# EasyEDA schematic Hysteresis.json
TITLE: Hysteresys for wind turbine; REV: 1.0; Date: 2024-12-05; Sheet: 1/1; Drawn By: AmirB; Company: Energy Exhibit
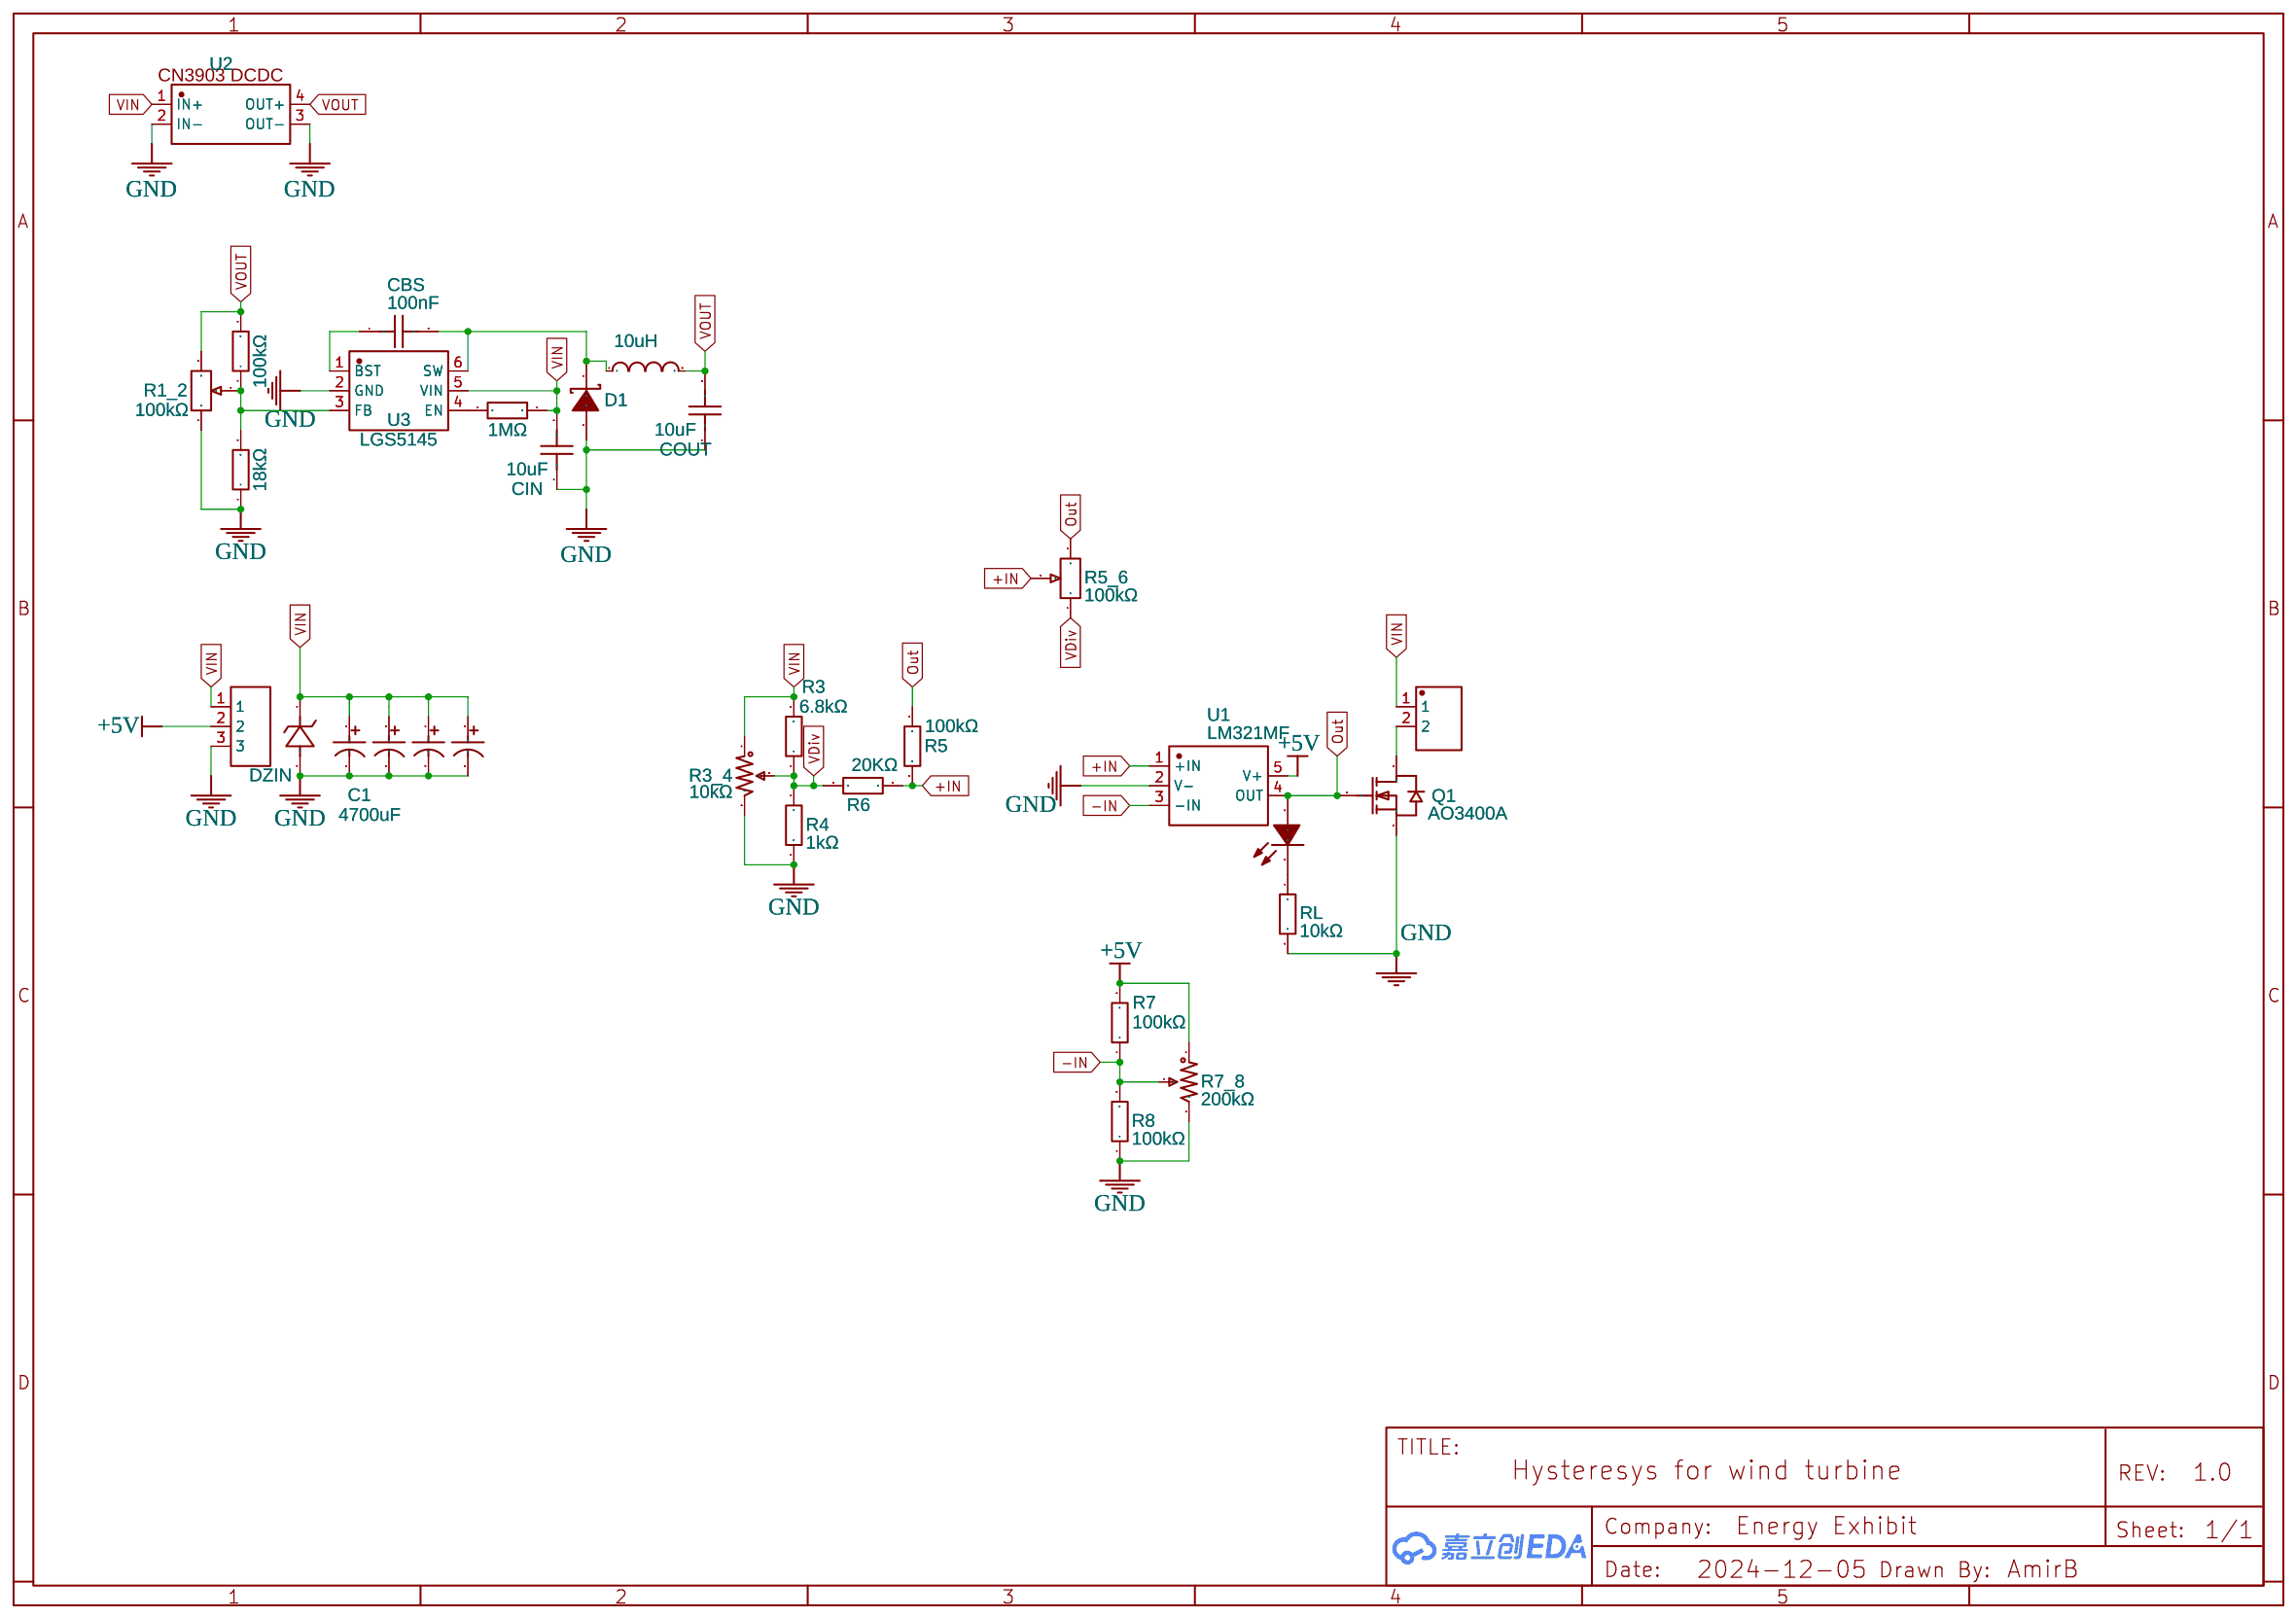
[diagram p0: schematic sheet]

## Parts
C1  4700uF  [CAP-TH_BD18.0-P7.50-D1.2-FD]
C2  4700uF  [CAP-TH_BD18.0-P7.50-D1.2-FD]
C3  4700uF  [CAP-TH_BD18.0-P7.50-D1.2-FD]
C4  4700uF  [CAP-TH_BD18.0-P7.50-D1.2-FD]
CBS  100nF  [C0603]
CIN  10uF  [C0805]
CON_VIN  FK2510  [CONN-TH_3P-P2.00_KF2510_3A]
COUT  10uF  [C0805]
D1  SS210  [SMA_L4.3-W2.6-LS5.2-RD]
DZIN  SMBJ5361B  [SMB_L4.3-W3.6-LS5.2-RD]
L1  10uH  [IND-SMD_L5.4-W5.2]
LED  KT-0603R  [LED0603-RD]
Q1  AO3400A  [SOT-23-3_L2.9-W1.3-P1.90-LS2.4-BR]
R1  100kΩ  [R0603]
R1_2  100kΩ  [RES-ADJ-TH_3P-L9.5-W4.9-P2.50-L_3296W]
R2  18kΩ  [R0603]
R3  6.8kΩ  [R0603]
R3_4  10kΩ  [RES-ADJ-TH_3P-L10.0-W10.0-P2.50-L]
R4  1kΩ  [R0603]
R5  100kΩ  [R0603]
R5_6  100kΩ  [RES-ADJ-TH_3P-L9.5-W4.9-P2.50-L_3296W]
R6  20KΩ  [R0603]
R7  100kΩ  [R0603]
R7_8  200kΩ  [RES-ADJ-TH_3P-L9.5-W4.85-P2.50-BL-BS]
R8  100kΩ  [R0603]
REN  1MΩ  [R0603]
RL  10kΩ  [R0603]
U1  LM321MF  [SOT-23-5_L2.9-W1.6-P0.95-LS2.8-BL]
U2  CN3903-DCDC-STEPDOWN-3V3  [CN3903 DCDC]
U3  LGS5145  [SOT-23-6_L2.9-W1.7-P0.95-LS2.8-BL]
VHYS  KF2510-2A  [CONN-TH_KF2510-2A]

## Library data of the parts
C1-C4 = 4700uF 35V 18*30: Supplier: LCSC; Manufacturer: CX(承兴); Supplier Part: C43354; JLCPCB Part Class: Extended Part; Package Display: No
CBS = CC0603KRX7R9BB104: Supplier: LCSC; Manufacturer: YAGEO(国巨); Supplier Part: C14663; JLCPCB Part Class: Basic Part; Package Display: No
CIN COUT = GRM21BR61H106KE43L: Contributor: LCSC; Supplier: LCSC; Supplier Part: C440198; Manufacturer: muRata(村田); JLCPCB Part Class: Basic Part; Package Display: No
CON_VIN = kf2510_3A: JLCPCB Part Class: Extended Part; Package Display: No
D1 = SS210: Supplier: LCSC; Manufacturer: MDD(辰达半导体); Supplier Part: C14996; JLCPCB Part Class: Basic Part; Package Display: No
DZIN = SMBJ5361B: Contributor: lcsc; Supplier: LCSC; Supplier Part: C2940171; Manufacturer: LGE(鲁光); JLCPCB Part Class: Extended Part; Package Display: No
L1 = MWSA0503S-100MT: Contributor: LCSC; Supplier: LCSC; Supplier Part: C408412; Manufacturer: Sunlord(顺络); JLCPCB Part Class: Extended Part; Package Display: No
LED = KT-0603R: Supplier: LCSC; Manufacturer: KENTO; Supplier Part: C2286; JLCPCB Part Class: Basic Part; Package Display: No
Q1 = AO3400A: Supplier: LCSC; Manufacturer: AOS; Supplier Part: C20917; JLCPCB Part Class: Basic Part; Package Display: No
R1 R5 R7 R8 = 0603WAF1003T5E: Supplier: LCSC; Manufacturer: UNI-ROYAL(厚声); Supplier Part: C25803; JLCPCB Part Class: Basic Part; Package Display: No
R1_2 R5_6 = 3296W-1-104: Resistance(Ohms): 100K; Contributor: LCSC; Supplier: LCSC; Supplier Part: C118963; Manufacturer: BOCHEN(博晨); JLCPCB Part Class: Extended Part; Package Display: No
R2 = 0603WAF1802T5E: Supplier: LCSC; Manufacturer: UNI-ROYAL(厚声); Supplier Part: C25810; JLCPCB Part Class: Basic Part; Package Display: No
R3 = 0603WAF6801T5E: Supplier: LCSC; Manufacturer: UNI-ROYAL(厚声); Supplier Part: C23212; JLCPCB Part Class: Basic Part; Package Display: No
R3_4 = 3296W-1-103: Resistance(Ohms): 10K; Contributor: LCSC; Supplier: LCSC; Supplier Part: C118954; Manufacturer: BOCHEN(博晨); JLCPCB Part Class: Extended Part; Package Display: No
R4 = 0603WAF1001T5E: Supplier: LCSC; Manufacturer: UNI-ROYAL(厚声); Supplier Part: C21190; JLCPCB Part Class: Basic Part; Package Display: No
R6 = 0603WAF200JT5E: Supplier: LCSC; Manufacturer: UNI-ROYAL(厚声); Supplier Part: C22950; JLCPCB Part Class: Basic Part; Package Display: No
R7_8 = 3296W-1-204: Resistance(Ohms): 200K; Contributor: LCSC; Supplier: LCSC; Supplier Part: C118942; Manufacturer: BOCHEN(博晨); JLCPCB Part Class: Extended Part; Package Display: No
REN = 0603WAF1004T5E: Supplier: LCSC; Manufacturer: UNI-ROYAL(厚声); Supplier Part: C22935; JLCPCB Part Class: Basic Part; Package Display: No
RL = 0603WAF1002T5E: Supplier: LCSC; Manufacturer: UNI-ROYAL(厚声); Supplier Part: C25804; Resistance (Ohms): 10K; JLCPCB Part Class: Basic Part; Package Display: No
U1 = LM321MF: Contributor: LCSC; Supplier: LCSC; Supplier Part: C668208; Manufacturer: UMW(友台半导体); JLCPCB Part Class: Extended Part; Package Display: No
U2 = CN3903-DCDC-STEPDOWN-3V3: Supplier: Aliexpress; link: https://www.aliexpress.com/item/1005002830334910.html?spm=a2g0s.9042311.0.0.251d4c4ddfGCCY; Contributor: haukurhafsteins; Package Display: Yes
U3 = LGS5145: Contributor: lcsc; Supplier: LCSC; Supplier Part: C5123971; Manufacturer: Legend-Si(棱晶半导体); JLCPCB Part Class: Extended Part; Package Display: No
VHYS = KF2510-2A: Supplier: LCSC; Manufacturer: BOOMELE; Supplier Part: C27543; JLCPCB Part Class: Extended Part; Package Display: No

## Nets
+5V: CON_VIN.2 R7.2 R7_8.1 U1.5(V+)
GND: C1.2 C2.2 C3.2 C4.2 CIN.1 CON_VIN.3 COUT.1 D1.2(A) DZIN.2(A) Q1.2(S) R1_2.1 R2.1 R3_4.3 R4.1 R7_8.3 R8.1 RL.2 U1.2(V-) U2.2(IN-) U2.3(OUT-) U3.2(GND)
VIN: C1.1 C2.1 C3.1 C4.1 CIN.2 CON_VIN.1 DZIN.1(K) R3.2 R3_4.1 REN.1 U2.1(IN+) U3.5(VIN) VHYS.1
+IN: R5.2 R5_6.2 R6.2 U1.1(+IN)
-IN: R7.1 R7_8.2 R8.2 U1.3(-IN)
Out: LED.2(A) Q1.1(G) R5.1 R5_6.3 U1.4(OUT)
VDiv: R3.1 R3_4.2 R4.2 R5_6.1 R6.1
VOUT: COUT.2 L1.2 R1.2 R1_2.3 U2.4(OUT+)
Net-(CBS-1): CBS.1 U3.1(BST)
Net-(CBS-2): CBS.2 D1.1(K) L1.1 U3.6(SW)
Net-(LED-1): LED.1(K) RL.1
Net-(Q1-3): Q1.3(D) VHYS.2
Net-(R1-1): R1.1 R1_2.2 R2.2 U3.3(FB)
Net-(REN-2): REN.2 U3.4(EN)
